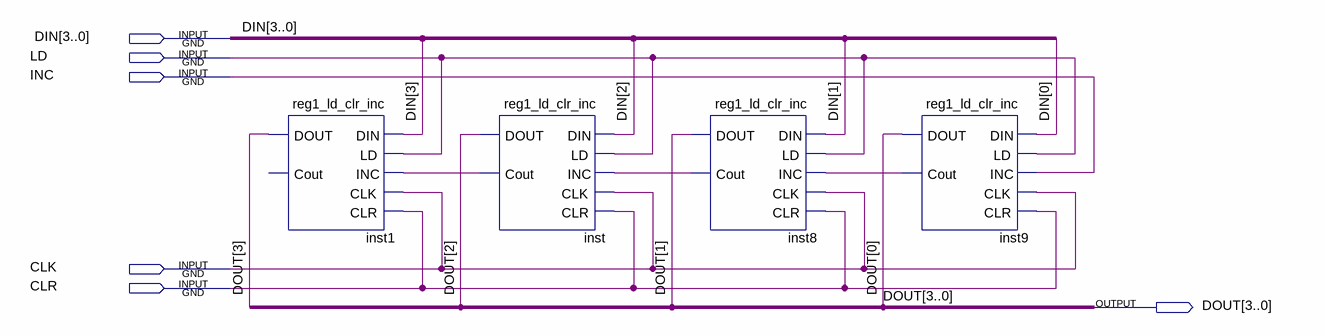
[diagram p0: schematic sheet]
// Quartus schematic reg4_ld_clr_inc.bdf as structural Verilog: 4 symbols, 6 pins
module reg4_ld_clr_inc (
  input  [3:0] DIN,
  input  LD,
  input  INC,
  input  CLK,
  input  CLR,
  output [3:0] DOUT
);

  wire inst8_cout, inst9_cout, inst_cout;

  reg1_ld_clr_inc inst1 (.DIN(DIN[3]), .LD(LD), .INC(inst_cout), .CLK(CLK), .CLR(CLR), .DOUT(DOUT[3]));  // open: Cout
  reg1_ld_clr_inc inst (
    .DIN(DIN[2]), .LD(LD), .INC(inst8_cout), .CLK(CLK), .CLR(CLR), .DOUT(DOUT[2]), .Cout(inst_cout));
  reg1_ld_clr_inc inst8 (
    .DIN(DIN[1]), .LD(LD), .INC(inst9_cout), .CLK(CLK), .CLR(CLR), .DOUT(DOUT[1]), .Cout(inst8_cout));
  reg1_ld_clr_inc inst9 (.DIN(DIN[0]), .LD(LD), .INC(INC), .CLK(CLK), .CLR(CLR), .DOUT(DOUT[0]), .Cout(inst9_cout));
endmodule
